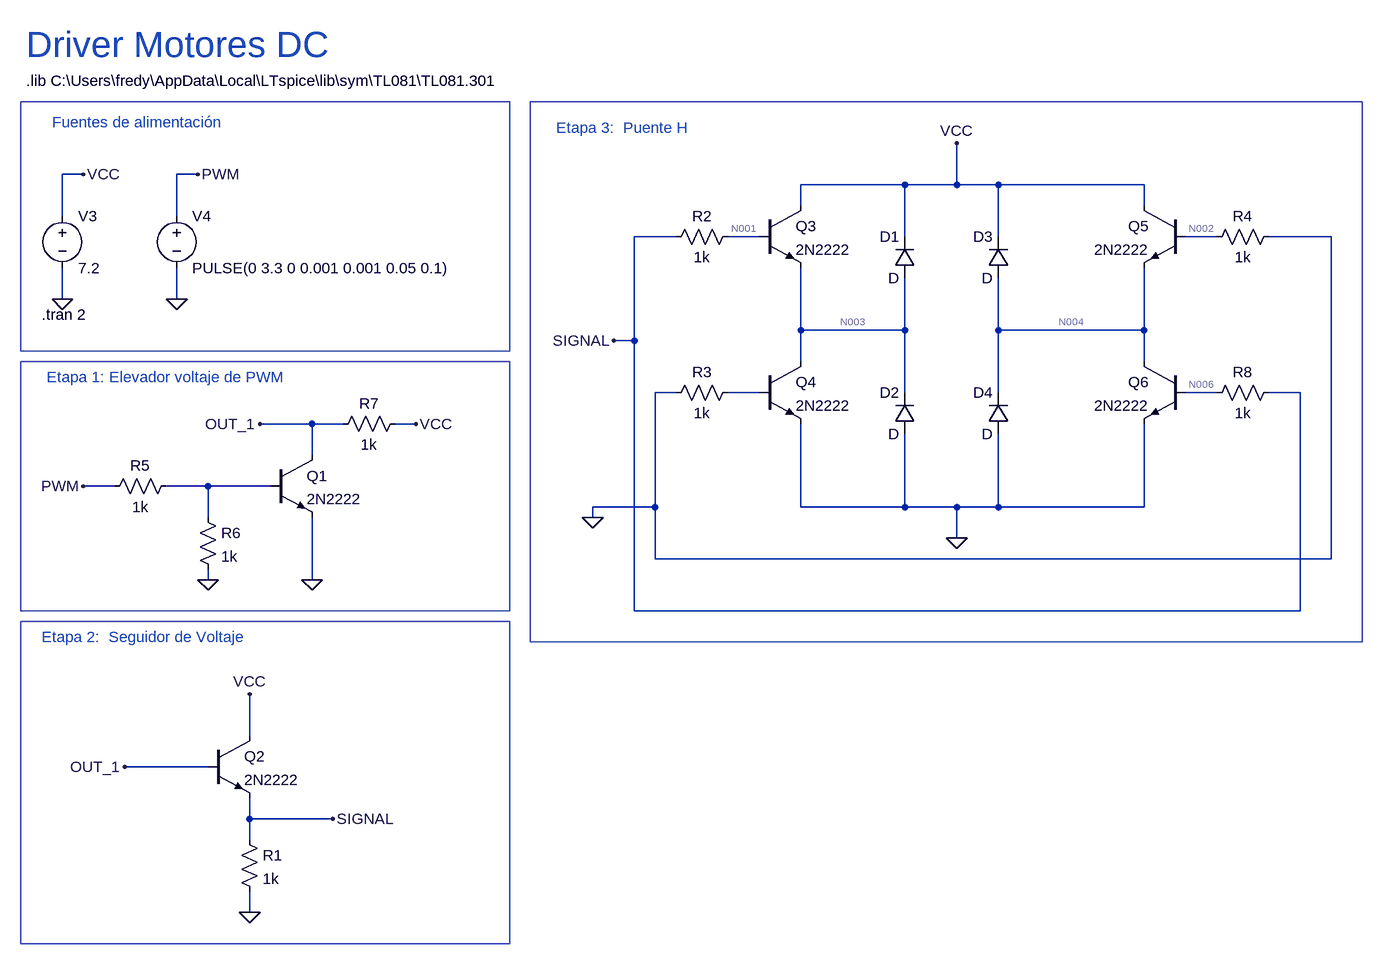
[diagram p0: schematic DriverMotor.asc]
DriverMotor.asc, the LTspice schematic file:
Version 4
SHEET 1 2180 2148
WIRE -160 304 -192 304
WIRE 16 304 -16 304
WIRE 1104 320 944 320
WIRE 1184 320 1184 256
WIRE 1184 320 1104 320
WIRE 1248 320 1184 320
WIRE 1472 320 1248 320
WIRE 944 352 944 320
WIRE 1472 352 1472 320
WIRE -192 368 -192 304
WIRE -16 368 -16 304
WIRE 752 400 688 400
WIRE 880 400 832 400
WIRE 1104 400 1104 320
WIRE 1248 400 1248 320
WIRE 1584 400 1536 400
WIRE 1760 400 1664 400
WIRE -192 496 -192 448
WIRE -16 496 -16 448
WIRE 944 544 944 448
WIRE 1104 544 1104 464
WIRE 1104 544 944 544
WIRE 1248 544 1248 464
WIRE 1472 544 1472 448
WIRE 1472 544 1248 544
WIRE 688 560 688 400
WIRE 688 560 656 560
WIRE 944 592 944 544
WIRE 1472 592 1472 544
WIRE 752 640 720 640
WIRE 880 640 832 640
WIRE 1104 640 1104 544
WIRE 1248 640 1248 544
WIRE 1584 640 1536 640
WIRE 1712 640 1664 640
WIRE 192 688 112 688
WIRE 240 688 192 688
WIRE 352 688 320 688
WIRE 192 736 192 688
WIRE -112 784 -160 784
WIRE 32 784 -32 784
WIRE 128 784 32 784
WIRE 720 816 720 640
WIRE 720 816 624 816
WIRE 944 816 944 688
WIRE 1104 816 1104 704
WIRE 1104 816 944 816
WIRE 1184 816 1104 816
WIRE 1248 816 1248 704
WIRE 1248 816 1184 816
WIRE 1472 816 1472 688
WIRE 1472 816 1248 816
WIRE 32 832 32 784
WIRE 624 832 624 816
WIRE 1184 864 1184 816
WIRE 720 896 720 816
WIRE 1760 896 1760 400
WIRE 1760 896 720 896
WIRE 32 928 32 912
WIRE 192 928 192 832
WIRE 688 976 688 560
WIRE 1712 976 1712 640
WIRE 1712 976 688 976
WIRE 96 1168 96 1104
WIRE 32 1216 -96 1216
WIRE 96 1296 96 1264
WIRE 224 1296 96 1296
WIRE 96 1328 96 1296
WIRE 96 1440 96 1408
FLAG -192 496 0
FLAG -160 304 VCC
FLAG -16 496 0
FLAG 16 304 PWM
FLAG -160 784 PWM
FLAG 192 928 0
FLAG 352 688 VCC
FLAG 32 928 0
FLAG 112 688 OUT_1
FLAG 1184 864 0
FLAG 1184 256 VCC
FLAG 624 832 0
FLAG 96 1440 0
FLAG 96 1104 VCC
FLAG -96 1216 OUT_1
FLAG 224 1296 SIGNAL
FLAG 656 560 SIGNAL
SYMBOL npn 128 736 R0
SYMATTR InstName Q1
SYMATTR Value 2N2222
SYMBOL voltage -192 352 R0
WINDOW 123 0 0 Left 0
WINDOW 39 0 0 Left 0
SYMATTR InstName V3
SYMATTR Value 7.2
SYMBOL voltage -16 352 R0
WINDOW 123 0 0 Left 0
WINDOW 39 0 0 Left 0
SYMATTR InstName V4
SYMATTR Value PULSE(0 3.3 0 0.001 0.001 0.05 0.1)
SYMBOL res -16 768 R90
WINDOW 0 0 56 VBottom 2
WINDOW 3 32 56 VTop 2
SYMATTR InstName R5
SYMATTR Value 1k
SYMBOL res 16 816 R0
SYMATTR InstName R6
SYMATTR Value 1k
SYMBOL res 336 672 R90
WINDOW 0 0 56 VBottom 2
WINDOW 3 32 56 VTop 2
SYMATTR InstName R7
SYMATTR Value 1k
SYMBOL diode 1120 464 R180
WINDOW 0 24 64 Left 2
WINDOW 3 24 0 Left 2
SYMATTR InstName D1
SYMBOL diode 1120 704 R180
WINDOW 0 24 64 Left 2
WINDOW 3 24 0 Left 2
SYMATTR InstName D2
SYMBOL diode 1264 464 R180
WINDOW 0 24 64 Left 2
WINDOW 3 24 0 Left 2
SYMATTR InstName D3
SYMBOL diode 1264 704 R180
WINDOW 0 24 64 Left 2
WINDOW 3 24 0 Left 2
SYMATTR InstName D4
SYMBOL npn 32 1168 R0
SYMATTR InstName Q2
SYMATTR Value 2N2222
SYMBOL res 80 1312 R0
SYMATTR InstName R1
SYMATTR Value 1k
SYMBOL npn 880 352 R0
SYMATTR InstName Q3
SYMATTR Value 2N2222
SYMBOL npn 880 592 R0
SYMATTR InstName Q4
SYMATTR Value 2N2222
SYMBOL npn 1536 352 M0
SYMATTR InstName Q5
SYMATTR Value 2N2222
SYMBOL npn 1536 592 M0
SYMATTR InstName Q6
SYMATTR Value 2N2222
SYMBOL res 848 384 R90
WINDOW 0 0 56 VBottom 2
WINDOW 3 32 56 VTop 2
SYMATTR InstName R2
SYMATTR Value 1k
SYMBOL res 848 624 R90
WINDOW 0 0 56 VBottom 2
WINDOW 3 32 56 VTop 2
SYMATTR InstName R3
SYMATTR Value 1k
SYMBOL res 1680 384 R90
WINDOW 0 0 56 VBottom 2
WINDOW 3 32 56 VTop 2
SYMATTR InstName R4
SYMATTR Value 1k
SYMBOL res 1680 624 R90
WINDOW 0 0 56 VBottom 2
WINDOW 3 32 56 VTop 2
SYMATTR InstName R8
SYMATTR Value 1k
TEXT -248 160 Left 2 !.lib C:\\Users\\fredy\\AppData\\Local\\LTspice\\lib\\sym\\TL081\\TL081.301
TEXT -224 520 Left 2 !.tran 2
TEXT -248 104 Left 5 ;Driver Motores DC
TEXT -208 224 Left 2 ;Fuentes de alimentación
TEXT -216 616 Left 2 ;Etapa 1: Elevador voltaje de PWM
TEXT -224 1016 Left 2 ;Etapa 2:  Seguidor de Voltaje
TEXT 568 232 Left 2 ;Etapa 3:  Puente H
RECTANGLE Normal 496 576 -256 192
RECTANGLE Normal 496 976 -256 592
RECTANGLE Normal 496 1488 -256 992
RECTANGLE Normal 1808 1024 528 192

The netlist it stands for:
* DriverMotor.asc
Q1 OUT_1 N007 0 0 2N2222
V3 VCC 0 7.2
V4 PWM 0 PULSE(0 3.3 0 0.001 0.001 0.05 0.1)
R5 N007 PWM 1k
R6 N007 0 1k
R7 VCC OUT_1 1k
D1 N003 VCC D
D2 0 N003 D
D3 N004 VCC D
D4 0 N004 D
Q2 VCC OUT_1 SIGNAL 0 2N2222
R1 SIGNAL 0 1k
Q3 VCC N001 N003 0 2N2222
Q4 N003 N005 0 0 2N2222
Q5 VCC N002 N004 0 2N2222
Q6 N004 N006 0 0 2N2222
R2 N001 SIGNAL 1k
R3 N005 0 1k
R4 0 N002 1k
R8 SIGNAL N006 1k
.model D D
.lib standard.dio
.model NPN NPN
.model PNP PNP
.lib standard.bjt
.lib C:\Users\fredy\AppData\Local\LTspice\lib\sym\TL081\TL081.301
.tran 2
* Driver Motores DC
* Fuentes de alimentación
* Etapa 1: Elevador voltaje de PWM
* Etapa 2:  Seguidor de Voltaje
* Etapa 3:  Puente H
.backanno
.end

* Results of the author's LTspice run, read from the files saved beside the schematic
* Operating Point, zero values left out:
*   V(out_1) = 7.138 V
*   V(vcc) = 7.2 V
*   V(n003) = 6.233 V
*   V(n004) = 9.064 mV
*   V(signal) = 6.414 V
*   V(n001) = 6.414 V
*   V(n002) = 7.212 nV
*   V(n006) = 792.9 mV
*   Ic(Q1) = 7.156 pA
*   Ib(Q1) = -7.141 pA
*   Ic(Q2) = 11.97 mA
*   Ib(Q2) = 62.22 µA
*   Ie(Q2) = -12.04 mA
*   Ic(Q3) = 12.06 pA
*   Ie(Q3) = -11.51 pA
*   Ic(Q4) = 6.25 pA
*   Ib(Q4) = -6.236 pA
*   Ic(Q5) = 7.212 pA
*   Ib(Q5) = -7.212 pA
*   Ic(Q6) = 7.187 pA
*   Ib(Q6) = 5.621 mA
*   Ie(Q6) = -5.621 mA
*   I(D2) = -6.243 pA
*   I(D3) = -7.201 pA
*   I(R5) = 3.571 pA
*   I(R6) = 3.571 pA
*   I(R7) = 62.22 µA
*   I(R1) = 6.414 mA
*   I(R3) = 6.236 pA
*   I(R4) = -7.212 pA
*   I(R8) = 5.621 mA
*   I(V3) = -12.04 mA
*   I(V4) = 3.571 pA
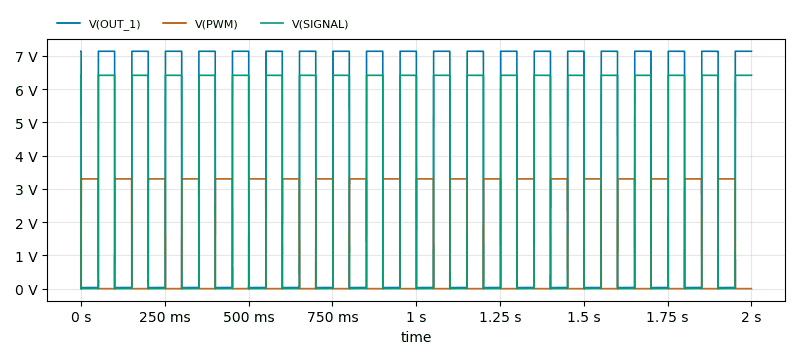
[diagram p1: Transient Analysis of DriverMotor.asc, plotted from the saved traces]
* Transient Analysis, 1 run:
*   V(OUT_1): min 30.56 mV, max 7.138 V, average 3.502 V, rms 4.987 V, last 7.138 V
*   V(PWM): min 0 V, max 3.3 V, average 1.683 V, rms 2.349 V, last 0 V
*   V(SIGNAL): min -6.579 mV, max 6.414 V, average 3.132 V, rms 4.481 V, last 6.414 V